# EAGLE design LM3670.3.3 (EAGLE 9.2.2)
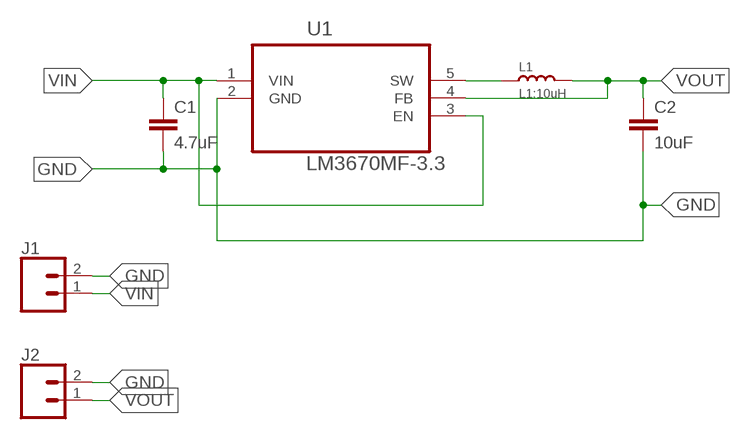
[diagram p0: schematic, sheet 1]

## Parts
C1  4.7uF  4.7UF0603  [0603]
C2  10uF  10UF-0805-10V-10%  [0805]
J1  CONN_02  [1X02]
J2  CONN_02  [1X02]
L1  L1:10uH  SMD-FERRITE-CHIP-120-OHM-500MA(0603)  [L0603]
U1  LM3670MF-3.3  [SOT95P284X122-5N]

## Nets
GND: C1.2 C2.2 J1.2 J2.2 U1.2(GND)
N$3: L1.1 U1.5(SW)
VIN: C1.1 J1.1 U1.1(VIN) U1.3(EN)
VOUT: C2.1 J2.1 L1.2 U1.4(FB)

## Library data of the parts
C1 = SparkFun-Capacitors:4.7UF: 4.7µF ceramic capacitors A capacitor is a passive two-terminal electrical component used to store electrical energy temporarily in an electric field.; PROD_ID: CAP-08280
C2 = SparkFun-Capacitors:10UF: 10.0µF ceramic capacitors A capacitor is a passive two-terminal electrical component used to store electrical energy temporarily in an electric field.; PROD_ID: CAP-11330
J1 J2 = SparkFun-Connectors:CONN_02: Multi connection point. Often used as Generic Header-pin footprint for 0.1 inch spaced/style header connections On any of the 0.1 inch spaced packages, you can populate with these: Break Away Headers - Straight <https://www.sparkfun.com/products/116> (PRT-00116) Break Away Male Headers - Right Angle <https://www.sparkfun.com/products/553> (PRT-00553) Female Headers <https://www.sparkfun.com/products/115> (PRT-00115) Break Away Headers - Machine Pin <https://www.sparkfun.com/products/117> (PRT-00117) Break Away Female Headers - Swiss Machine Pin <https://www.sparkfun.com/products/743> (PRT-00743) For SCREWTERMINALS and SPRING TERMINALS visit here: Screw Terimnals on SparkFun.com <https://www.sparkfun.com/search/results?term=Screw+Terminals> (5mm/3.5mm/2.54mm spacing) This device is also useful as a general connection point to wire up your design to another part of your project. Our various solder wires solder well into these plated through hole pads. Hook-Up Wire - Assortment (Stranded, 22 AWG) <https://www.sparkfun.com/products/11375> (PRT-11375) Hook-Up Wire - Assortment (Solid Core, 22 AWG) <https://www.sparkfun.com/products/11367> (PRT-11367) View the entire wire category on our website here <https://www.sparkfun.com/categories/141> Special notes: Molex polarized connector foot print use with: PRT-08233 with associated crimp pins and housings. 2.54_SCREWTERM for use with PRT-10571. 3.5mm Screw Terminal footprints for PRT-08084 5mm Screw Terminal footprints for use with PRT-08432
L1 = Seeed-Inductor:SMD-FERRITE-CHIP-120-OHM-500MA(0603): 303030001; MPN: BLM18AG121SN1D; VALUE: 120OHM-500MA
U1 = LM3670MF-3.3:LM3670MF-3.3: IC BUCK 3.3V 350MA; AVAILABILITY: Unavailable; DESCRIPTION: Miniature Step-Down DC-DC Converter for Ultra Low Voltage Circuits 5-SOT-23 -40 to 85; MF: Texas Instruments; MP: LM3670MF-3.3; PACKAGE: SOT-23 Texas Instruments; PRICE: None

## Board
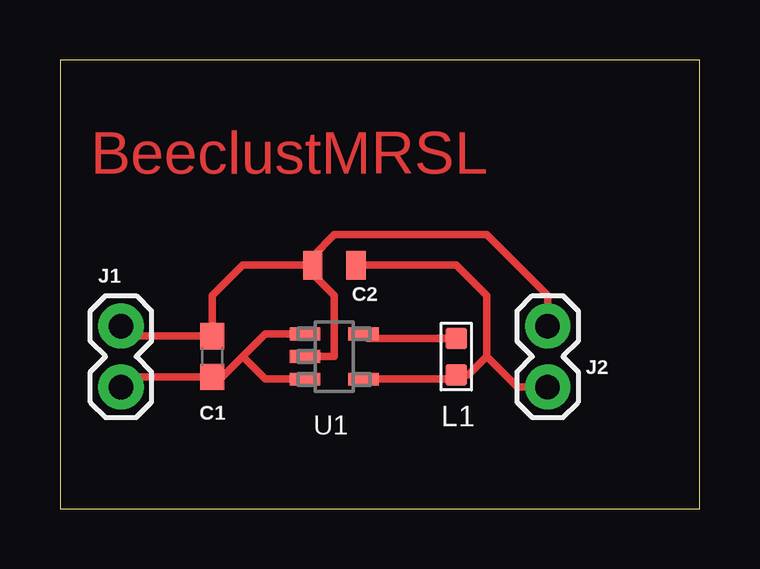
[diagram p1: board, top side]

Size 26.65 x 18.72 mm. Coordinates in mm from the lower left corner, seen from the top.
Outline: 0,0 26.65,0 26.65,18.72 0,18.72 0,0
Copper layers (1*16): Top 0.035mm / dielectric 1.5mm / Bottom 0.035mm
Design rules "default": minimum track width 6mil, minimum drill 0.35mm, track to track 6mil, track to pad 6mil, pad to pad 6mil, via to via 6mil, smd to smd 6mil, copper to edge 40mil, drill to drill 6mil, minimum pad ring 10mil, minimum via ring 8mil, stop-mask expansion 4mil, vias tented up to drill 0mil, thermal gap 10mil

### Footprints (pad centres in the part's own frame; a part is rotated, then mirrored left to right if it is on the bottom)
0603 = smd 1.1 x 1: 1 -0.85,0; 2 0.85,0
0805 = smd 0.8 x 1.2: 1 -0.9,0; 2 0.9,0
1X02 = drill 1.016 pad 1.88: 1 0,0; 2 2.54,0
L0603 = smd 0.889 x 0.889: 1 -0.762,0; 2 0.762,0
SOT95P284X122-5N = smd 1.27 x 0.533: 1 -1.219,0.94; 2 -1.219,0; 3 -1.219,-0.94; 4 1.219,-0.94; 5 1.219,0.94

### Placement (x,y rotation side)
C1  6.35,6.35 90 top
C2  11.43,10.16 180 top
J1  2.54,5.08 90 top
J2  20.32,5.08 90 top
L1  16.51,6.35 270 top
U1  11.43,6.35 0 top

### Tracks (layer width: path | path; a pad name or v marks a point on that pad's centre or on a via)
GND
  Top 0.305: J2.2 20.32,8.89 17.78,11.43 11.43,11.43 10.53,10.53 C2.2 | U1.2 11.43,6.35 11.43,8.89 10.53,9.79 C2.2 | J1.2 2.96,7.2 C1.2 6.35,8.89 7.62,10.16 C2.2
N$3
  Top 0.305: L1.1 12.83,7.11 U1.5
VIN
  Top 0.305: 10.07,5.5 10.16,5.41 U1.3 8.56,5.41 7.62,6.35 | J1.1 2.96,5.5 C1.1 6.77,5.5 7.62,6.35 | U1.1 8.56,7.29 7.62,6.35
VOUT
  Top 0.305: C2.1 16.51,10.16 17.78,8.89 17.78,6.35 | 17.78,6.35 17.02,5.59 L1.2 16.33,5.41 U1.4 | 17.78,6.35 19.05,5.08 J2.1

### Text on the board
Top: BeeclustMRSL